# Altium schematic sheet MDQARM_SOUND.SchDoc
size A3; Organization: Altium Limited; Address1: L3, 12a Rodborough Rd; Address2: Frenchs Forest; Address3: NSW; Address4: Australia 2086
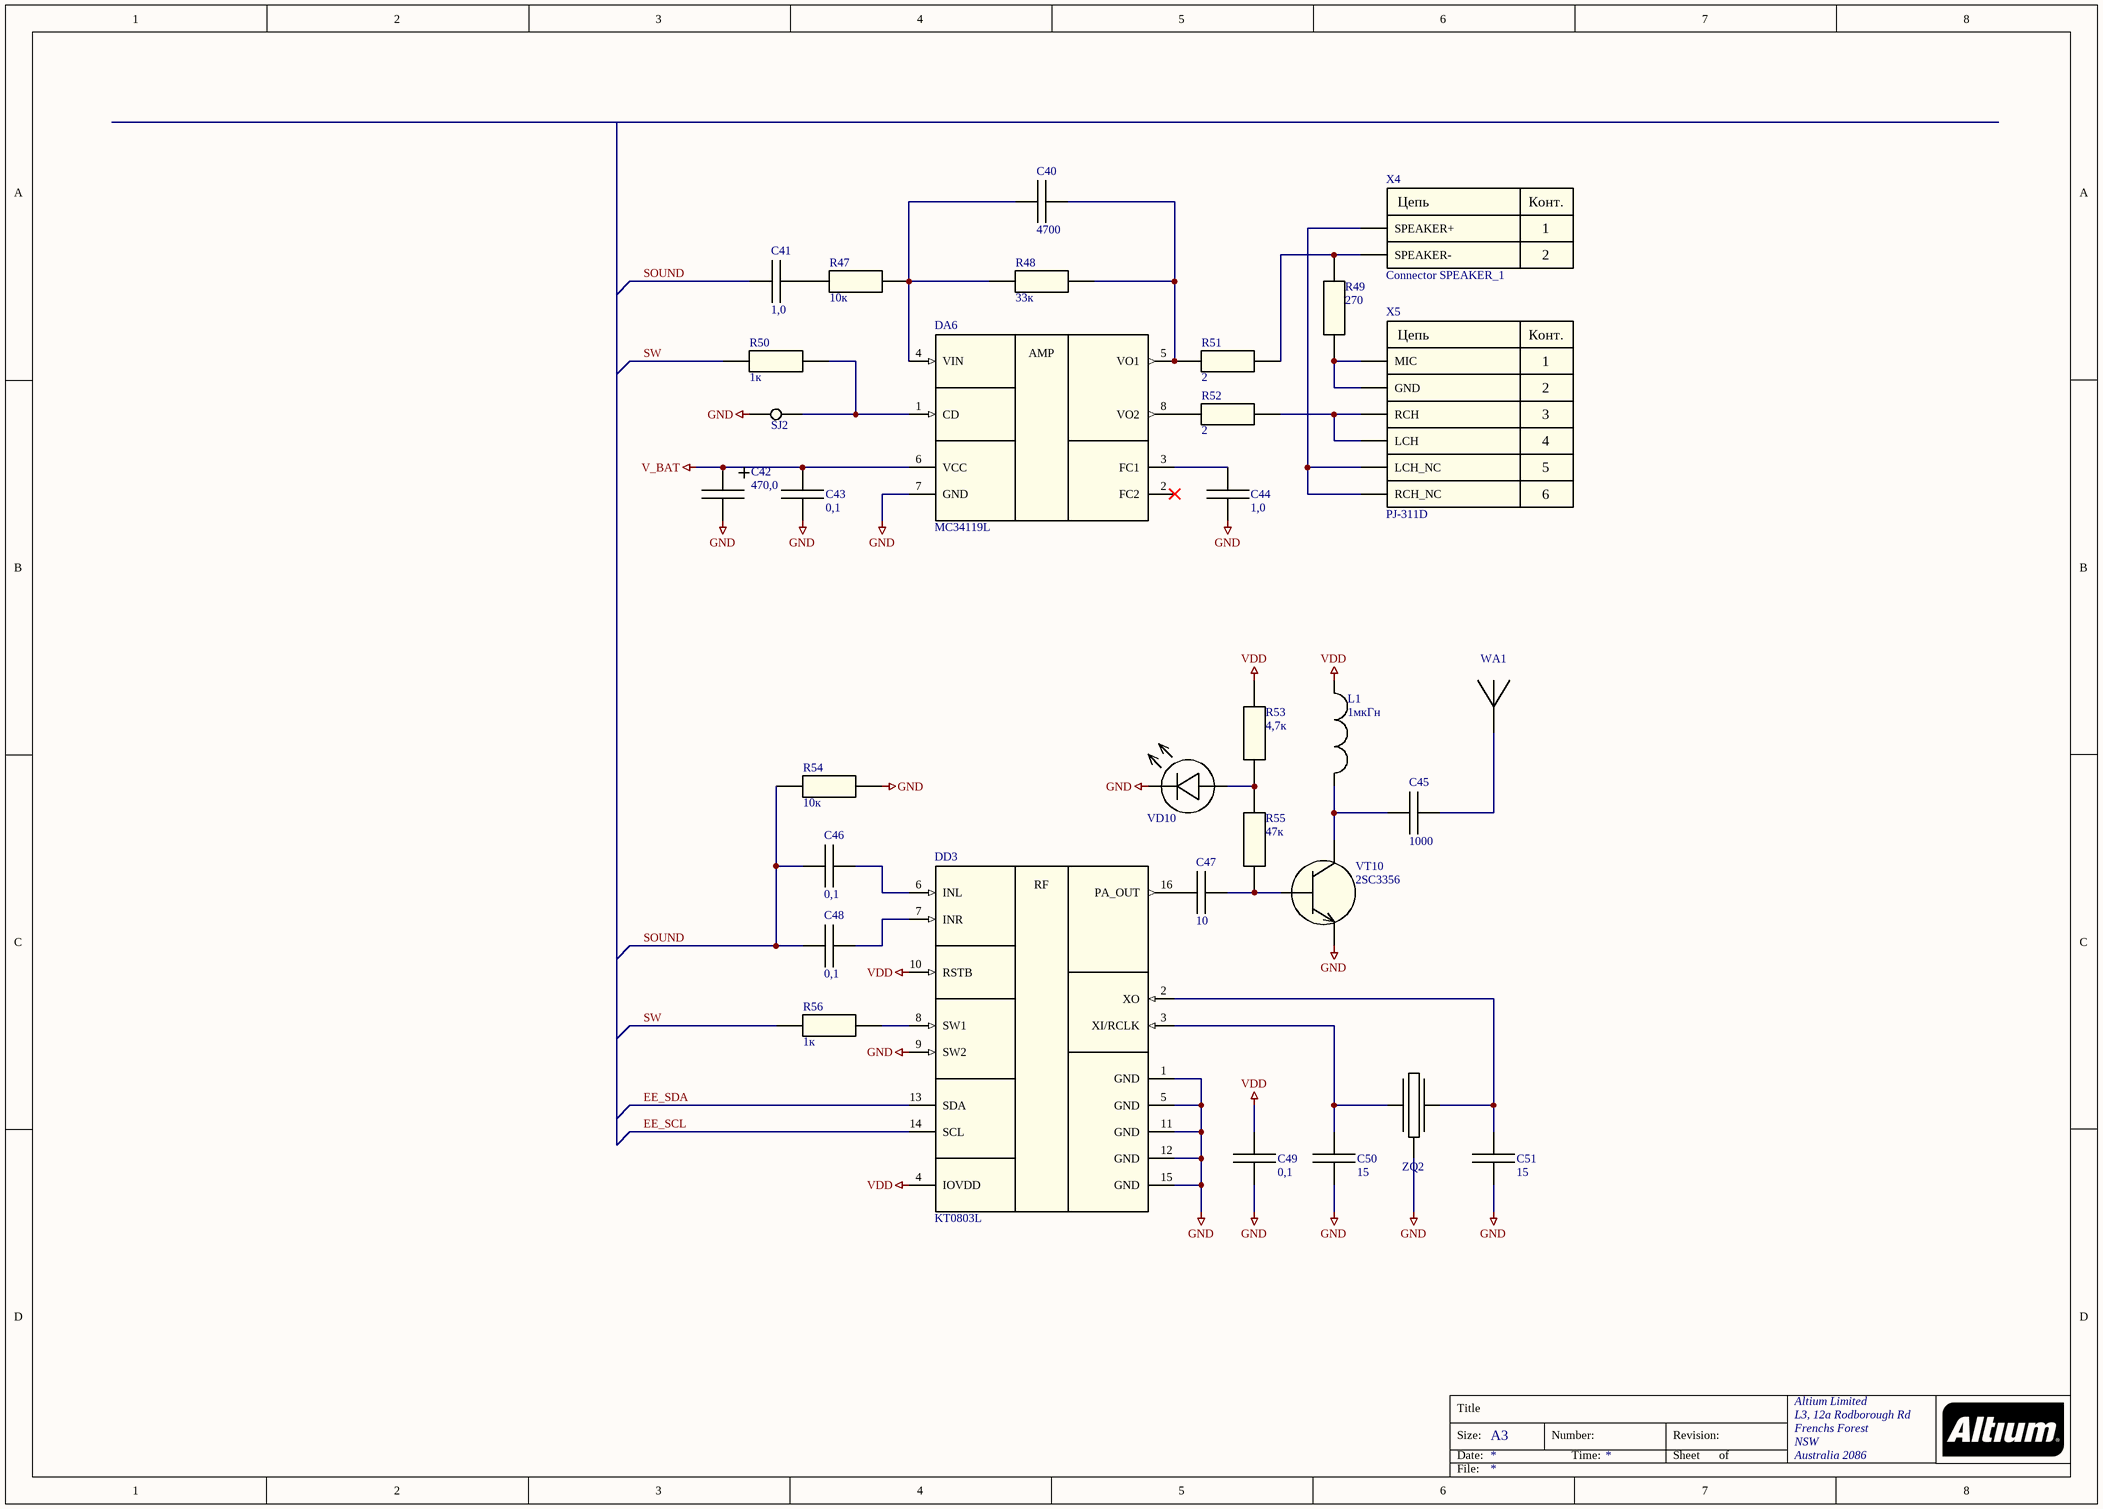
[diagram p0: MDQARM_SOUND.SchDoc]

## Parts
C40  4700  [Capacitor SMD0805-T0.75]
C41  1,0  [Capacitor SMD0805-T1.35]
C42  470,0  [Capacitor ECAP SMD10x10.5]
C43  0,1  [Capacitor SMD0805-T0.95]
C44  1,0  [Capacitor SMD0805-T1.35]
C45  1000  [Capacitor SMD0805-T0.75]
C46  0,1  [Capacitor SMD0805-T0.95]
C47  10  [Capacitor SMD0805-T0.75]
C48  0,1  [Capacitor SMD0805-T0.95]
C49  0,1  [Capacitor SMD0805-T0.95]
C50  15  [Capacitor SMD0805-T0.75]
C51  15  [Capacitor SMD0805-T0.75]
DA6  MC34119L  [IC MC34119L]
DD3  KT0803L  [IC KT0803L]
L1  1мкГн  [Inductor SMD1210]
R47  10к  [Resistor SMD0805]
R48  33к  [Resistor SMD0805]
R49  270  [Resistor SMD0805]
R50  1к  [Resistor SMD0805]
R51  2  [Resistor SMD0805]
R52  2  [Resistor SMD0805]
R53  4,7к  [Resistor SMD0805]
R54  10к  [Resistor SMD0805]
R55  47к  [Resistor SMD0805]
R56  1к  [Resistor SMD0805]
SJ2  SolderJump 1  [SolderJump 1]  (value not drawn)
VD10  RED  [Diode SMD0805]  (value not drawn)
VT10  2SC3356  [Transistor SOT23]
WA1  Antenna 1  [Antenna 1]  (value not drawn)
X4  Connector SPEAKER_1  [Connector SPEAKER]
X5  PJ-311D  [Connector PJ-311D]
ZQ2  32768 Гц  [Quartz DT-38T-32768Hz]  (value not drawn)

## Nets
GND: C42.2 C43.1 C44.1 C49.1 C50.2 C51.2 DA6.7(GND) DD3.1(GND) DD3.5(GND) DD3.9(SW2) DD3.11(GND) DD3.12(GND) DD3.15(GND) R54.2 SJ2.2 VD10.2(C) VT10.2(E) ZQ2.3(GND)
V_BAT: C42.1 C43.2 DA6.6(VCC)
VDD: C49.2 DD3.4(IOVDD) DD3.10(RSTB) L1.1 R53.1
EE_SCL: DD3.14(SCL)
EE_SDA: DD3.13(SDA)
SOUND: C41.1 C46.1 C48.1 R54.1
SW: R50.1 R56.1
NetC40_1: C40.1 DA6.4(VIN) R47.2 R48.1
NetC40_2: C40.2 DA6.5(VO1) R48.2 R51.1
NetC41_2: C41.2 R47.1
NetC44_2: C44.2 DA6.3(FC1)
NetC45_1: C45.1 L1.2 VT10.3(C)
NetC45_2: C45.2 WA1.1
NetC46_2: C46.2 DD3.6(INL)
NetC47_1: C47.1 DD3.16(PA_OUT)
NetC47_2: C47.2 R55.1 VT10.1(B)
NetC48_2: C48.2 DD3.7(INR)
NetC50_1: C50.1 DD3.3(XI/RCLK) ZQ2.1
NetC51_1: C51.1 DD3.2(XO) ZQ2.2
NetDA6_1: DA6.1(CD) R50.2 SJ2.1
NetDA6_8: DA6.8(VO2) R52.1
NetDD3_8: DD3.8(SW1) R56.2
NetR49_1: R49.1 X5.1(MIC) X5.2(GND)
NetR49_2: R49.2 R51.2 X4.2(SPEAKER-)
NetR52_2: R52.2 X5.3(RCH) X5.4(LCH)
NetR53_2: R53.2 R55.2 VD10.1(A)
NetX4_1: X4.1(SPEAKER+) X5.5(LCH_NC) X5.6(RCH_NC)

Not connected (* = marked no-connect by the designer): DA6 2(FC2)*

## Notes on the sheet
- Title
- Size:
- Date:
- A3
- Number:
- Time:
- Revision:
- Sheet
- of
- File:
- (in symbol Connector PJ-311D) Цепь; Конт.
- (in symbol Connector SPEAKER_1) Цепь; Конт.
- (in symbol IC KT0803L) RF
- (in symbol IC MC34119L) AMP

## Library data of the parts
C40 = Capacitor C0805_4.7n: Value: 4700
C41 C44 = Capacitor C0805_1u: Value: 1,0
C42 = Capacitor ECAP SMD 470uF_16V: Value: 470,0
C43 C46 C48 C49 = Capacitor C0805_100n: Value: 0,1
C45 = Capacitor C0805_1n: Value: 1000
C47 = Capacitor C0805_10p: Value: 10
C50 C51 = Capacitor C0805_15p: Value: 15
DA6 = IC MC34119L: Value: MC34119L
DD3 = IC KT0803L: Value: KT0803L
L1 = Inductance L1210_1uH: Value: 1мкГн
R47 R54 = Resistor R0805_10k_5%: Value: 10к
R48 = Resistor R0805_33k_5%: Value: 33к
R49 = Resistor R0805_270R_5%: Value: 270
R50 R56 = Resistor R0805_1k_5%: Value: 1к
R51 R52 = Resistor R0805_2R_5%: Value: 2
R53 = Resistor R0805_4.7k_5%: Value: 4,7к
R55 = Resistor R0805_47k_5%: Value: 47к
VD10 = Diode LED0805RED: LED Red SMD0805
VT10 = Transistor 2SC3356: Value: 2SC3356
X5 = Connector PJ-311D: Audio Jack 3.5mm; Value: PJ-311D
ZQ2 = Quartz DT-38T-32768Hz: Value: DT-38T-32768Hz